# EAGLE schematic 190205_AVR-Control_V1.0 (EAGLE 6.6.0)
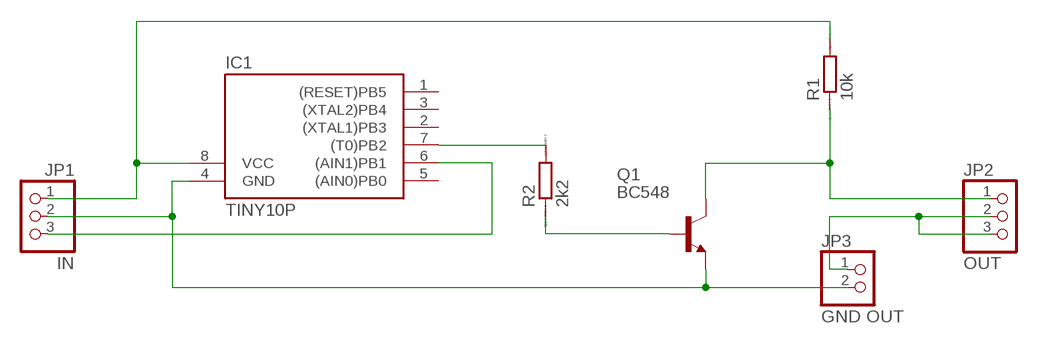
[diagram p0: schematic, sheet 1]

## Parts
IC1  TINY10P  [DIL08]
JP1  IN  PINHD-1X3/90  [1X03/90]
JP2  OUT  PINHD-1X3/90  [1X03/90]
JP3  GND OUT  PINHD-1X2  [1X02]
Q1  BC548  [TO92-EBC]
R1  10k  RR1206  [R1206]
R2  2k2  RR1206  [R1206]

## Nets
ATTINY_OUT: IC1.7((T0)PB2) R2.2
BASE: Q1.B R2.1
GND: IC1.4(GND) JP1.2 JP3.2 Q1.E
GND_OUTPUT: JP2.2 JP2.3 JP3.1
SIG_IN: IC1.6((AIN1)PB1) JP1.3
SIG_OUT: JP2.1 Q1.C R1.1
VCC [GND]: IC1.8(VCC) JP1.1 R1.2
Unconnected: IC1.1((RESET)PB5) IC1.2((XTAL1)PB3) IC1.3((XTAL2)PB4) IC1.5((AIN0)PB0)

## Library data of the parts
IC1 = atmel:TINY10: MICROCONTROLLER 1 Kbytes ROM; OC_FARNELL: unknown; OC_NEWARK: unknown
JP1 JP2 = pinhead:PINHD-1X3: PIN HEADER
JP3 = pinhead:PINHD-1X2: PIN HEADER
Q1 = transistor-npn:BC548*: NPN Transistor
R1 R2 = eagle-ltspice:R: RESISTOR, European symbol; SPICEMODEL: NONE; SPICEPREFIX: R